# EAGLE design poe_breakout (EAGLE 9.4.2)
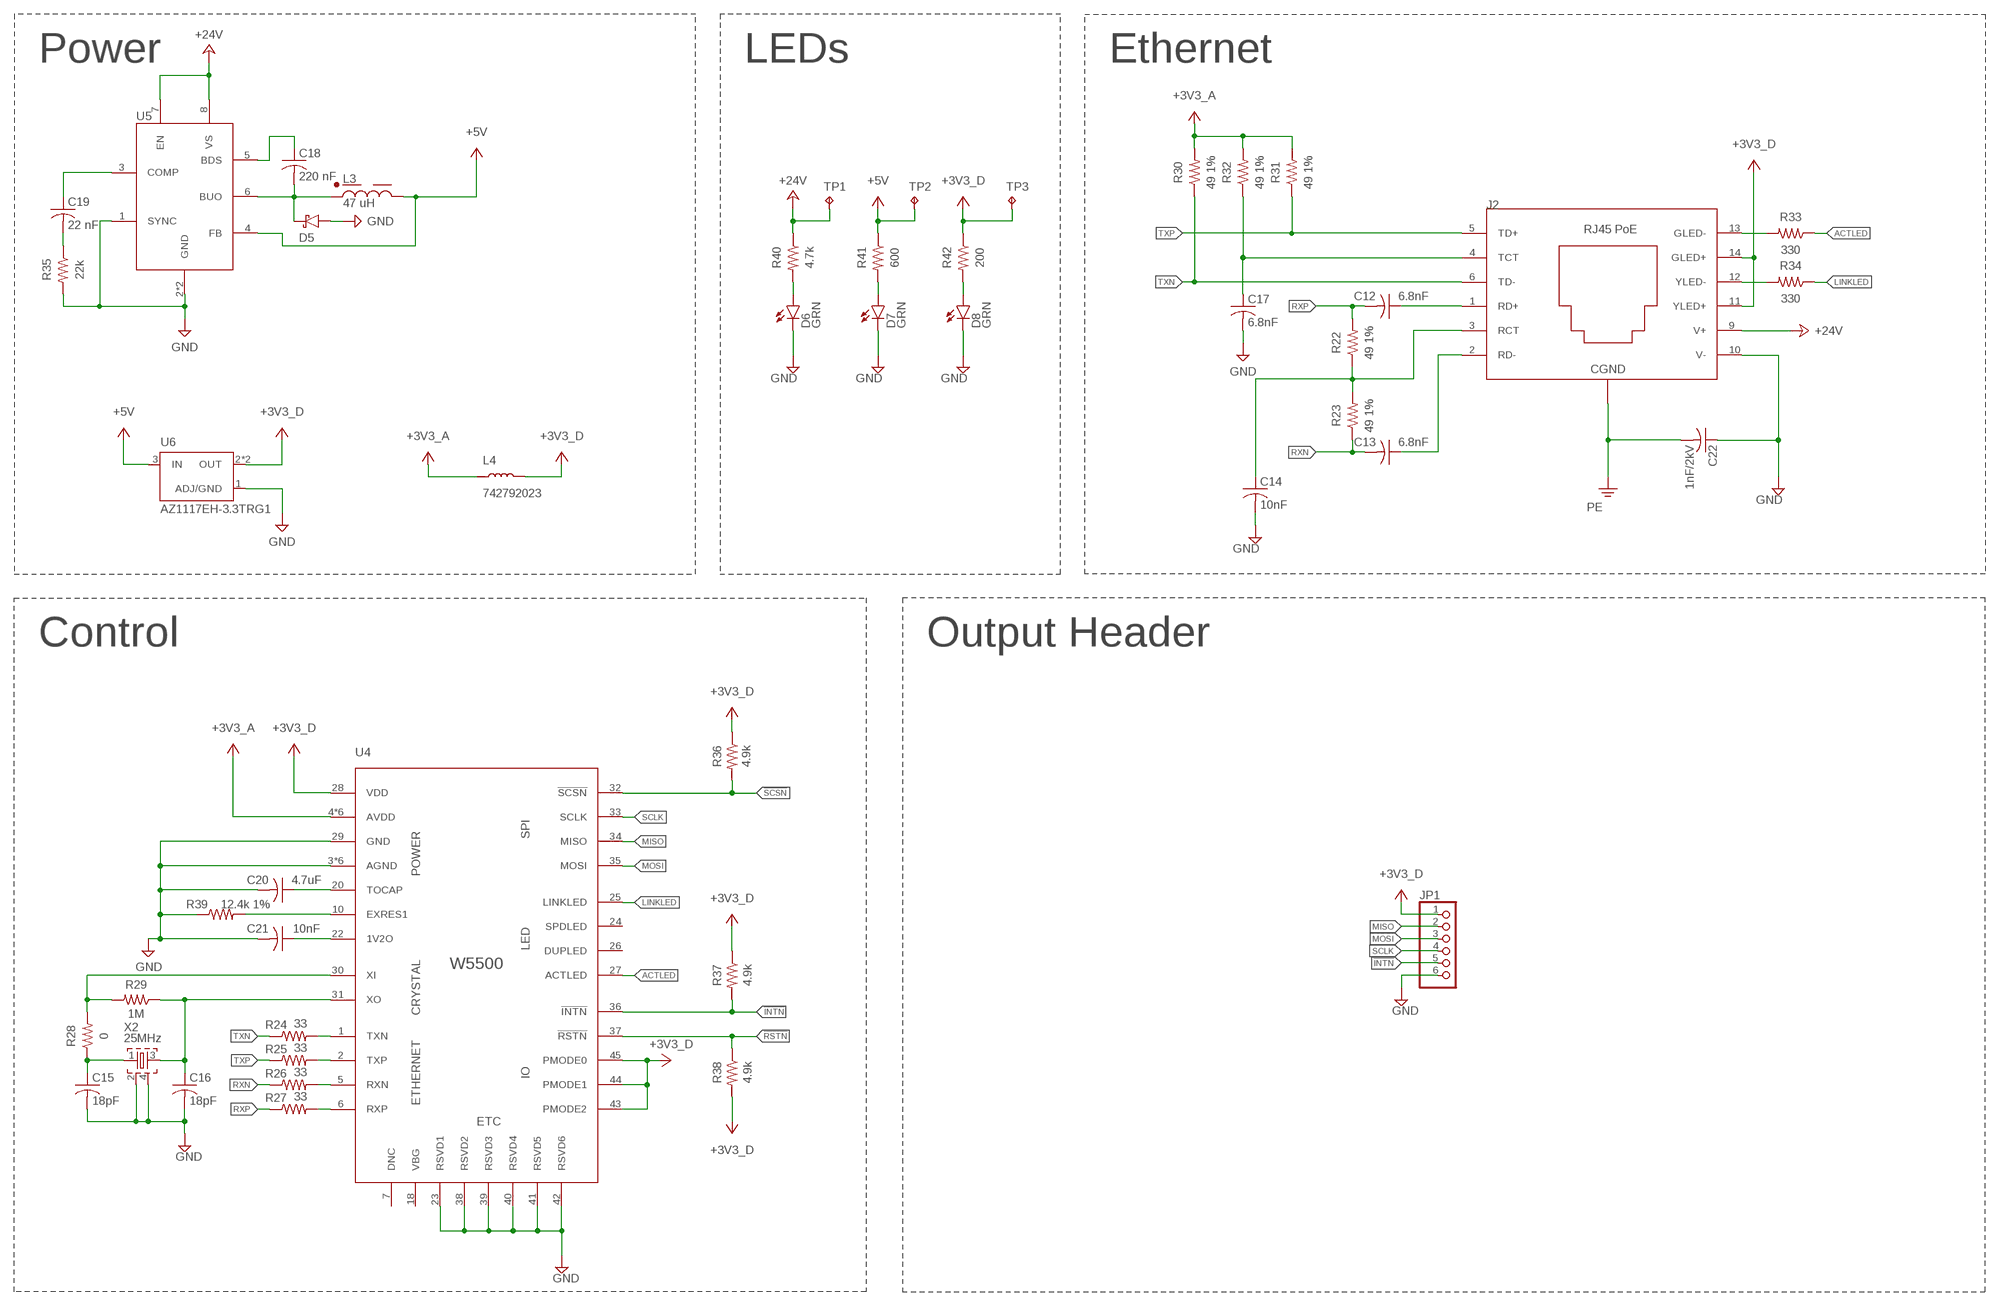
[diagram p0: schematic, sheet 1]

## Parts
C12  6.8nF  C-USC0603  [C0603]
C13  6.8nF  C-USC0603  [C0603]
C14  10nF  C-USC0603  [C0603]
C15  18pF  C-USC0603  [C0603]
C16  18pF  C-USC0603  [C0603]
C17  6.8nF  C-USC0603  [C0603]
C18  220 nF  C-USC0603  [C0603]
C19  22 nF  C-USC0603  [C0603]
C20  4.7uF  C-USC0603  [C0603]
C21  10nF  C-USC0603  [C0603]
C22  1nF/2kV  C-USC1206  [C1206]
D5  SCHOTTKYSOD-323  [SOD-323]
D6  GRN  LEDCHIP-LED0603  [CHIP-LED0603]
D7  GRN  LEDCHIP-LED0603  [CHIP-LED0603]
D8  GRN  LEDCHIP-LED0603  [CHIP-LED0603]
J2  ARJP11A  [ARJP11A-MBSB-A-B-EMU2]
JP1  PINHD-1X6  [1X06]
L3  47 uH  744771147  [744771147]
L4  742792023  INDUCTOR_0805  [0805]
R22  49 1%  R-US_R0603  [R0603]
R23  49 1%  R-US_R0603  [R0603]
R24  33  R-US_R0603  [R0603]
R25  33  R-US_R0603  [R0603]
R26  33  R-US_R0603  [R0603]
R27  33  R-US_R0603  [R0603]
R28  0  R-US_R0603  [R0603]
R29  1M  R-US_R0603  [R0603]
R30  49 1%  R-US_R0603  [R0603]
R31  49 1%  R-US_R0603  [R0603]
R32  49 1%  R-US_R0603  [R0603]
R33  330  R-US_R0603  [R0603]
R34  330  R-US_R0603  [R0603]
R35  22k  R-US_R0603  [R0603]
R36  4.9k  R-US_R0603  [R0603]
R37  4.9k  R-US_R0603  [R0603]
R38  4.9k  R-US_R0603  [R0603]
R39  12.4k 1%  R-US_R0603  [R0603]
R40  4.7k  R-US_R0603  [R0603]
R41  600  R-US_R0603  [R0603]
R42  200  R-US_R0603  [R0603]
TP1  TPB1,27  [B1,27]
TP2  TPB1,27  [B1,27]
TP3  TPB1,27  [B1,27]
U4  W5500  [48-LQFP]
U5  IFX91041  [SOIC-8-EXPOSED_PAD]
U6  AZ1117EH-3.3TRG1  [SOT230P700X180-4N]
X2  25MHz  ABM10W-25.0000MHZ-6-K1Z-T3  [OSCILLATOR-SMD-2.5X2]

## Nets
3V3_LED1: D8.A R42.2
5V_LED1: D7.A R41.2
24V_LED1: D6.A R40.2
!INTN: JP1.5 R37.2 U4.36(!INTN)
!RSTN: R38.1 U4.37(!RSTN)
!SCSN: R36.2 U4.32(!SCSN)
+3V3_A: L4.1 R30.2 R31.2 R32.2 U4.4(AVDD) U4.8(AVDD) U4.11(AVDD) U4.15(AVDD) U4.17(AVDD) U4.21(AVDD)
+3V3_D: J2.11(YLED+) J2.14(GLED+) JP1.1 L4.2 R36.1 R37.1 R38.2 R42.1 TP3.TP U4.28(VDD) U4.43(PMODE2) U4.44(PMODE1) U4.45(PMODE0) U6.2(OUT) U6.4(OUT)
+5V: L3.1 R41.1 TP2.TP U5.4(FB) U6.3(IN)
+24V: J2.9(V+) R40.1 TP1.TP U5.7(EN) U5.8(VS)
ACTLED: R33.1 U4.27(ACTLED)
GND: C14.2 C15.2 C16.2 C17.2 C20.2 C21.2 C22.1 D5.A D6.C D7.C D8.C J2.10(V-) JP1.6 R35.2 R39.1 U4.3(AGND) U4.9(AGND) U4.14(AGND) U4.16(AGND) U4.19(AGND) U4.23(RSVD1) U4.29(GND) U4.38(RSVD2) U4.39(RSVD3) U4.40(RSVD4) U4.41(RSVD5) U4.42(RSVD6) U4.48(AGND) U5.1(SYNC) U5.2(GND) U5.P$9(GND) U6.1(ADJ/GND) X2.2(SHD1) X2.4(SHD2)
LINKLED: R34.1 U4.25(LINKLED)
MISO: JP1.2 U4.34(MISO)
MOSI: JP1.3 U4.35(MOSI)
N$1: R24.2 U4.1(TXN)
N$2: R25.2 U4.2(TXP)
N$3: R26.2 U4.5(RXN)
N$6: R27.2 U4.6(RXP)
N$20: C15.1 R28.1 X2.1(IN)
N$22: R28.2 R29.2 U4.30(XI)
N$23: C16.1 R29.1 U4.31(XO) X2.3(OUT)
N$24: J2.12(YLED-) R34.2
N$25: J2.13(GLED-) R33.2
N$26: C18.2 D5.C L3.P$2 U5.6(BUO)
N$27: C18.1 U5.5(BDS)
N$28: C19.2 R35.1
N$29: C19.1 U5.3(COMP)
N$30: C21.1 U4.22(1V2O)
N$31: C20.1 U4.20(TOCAP)
N$32: R39.2 U4.10(EXRES1)
PE: C22.2 J2.15(CGND) J2.16(CGND)
RCT1: C14.1 J2.3(RCT) R22.1 R23.2
RD+1: C12.1 J2.1(RD+)
RD-1: C13.1 J2.2(RD-)
RXN: C13.2 R23.1 R26.1
RXP: C12.2 R22.2 R27.1
SCLK: JP1.4 U4.33(SCLK)
TCT1: C17.1 J2.4(TCT) R32.1
TXN: J2.6(TD-) R24.1 R30.1
TXP: J2.5(TD+) R25.1 R31.1
Unconnected: U4.7(DNC) U4.18(VBG) U4.24(SPDLED) U4.26(DUPLED)

## Notes on the sheet
- Power | LEDs | Ethernet
- Control | Output Header

## Library data of the parts
C12-C22 = rcl:C-US: CAPACITOR, American symbol; SPICEPREFIX: C
D5 = RoboJackets-Diodes:SCHOTTKY
D6-D8 = led:LED: LED OSRAM: - CHIPLED LG R971, LG N971, LY N971, LG Q971, LY Q971, LO R971, LY R971 LH N974, LH R974 LS Q976, LO Q976, LY Q976 LO Q996 - Hyper CHIPLED LW Q18S LB Q993, LB Q99A, LB R99A - SideLED LS A670, LO A670, LY A670, LG A670, LP A670 LB A673, LV A673, LT A673, LW A673 LH A674 LY A675 LS A676, LA A676, LO A676, LY A676, LW A676 LS A679, LY A679, LG A679 - Hyper Micro SIDELED® LS Y876, LA Y876, LO Y876, LY Y876 LT Y87S - SmartLED LW L88C, LW L88S LB L89C, LB L89S, LG L890 LS L89K, LO L89K, LY L89K LS L896, LA L896, LO L896, LY L896 - TOPLED LS T670, LO T670, LY T670, LG T670, LP T670 LSG T670, LSP T670, LSY T670, LOP T670, LYG T670 LG T671, LOG T671, LSG T671 LB T673, LV T673, LT T673, LW T673 LH T674 LS T676, LA T676, LO T676, LY T676, LB T676, LH T676, LSB T676, LW T676 LB T67C, LV T67C, LT T67C, LS T67K, LO T67K, LY T67K, LW E67C LS E67B, LA E67B, LO E67B, LY E67B, LB E67C, LV E67C, LT E67C LW T67C LS T679, LY T679, LG T679 LS T770, LO T770, LY T770, LG T770, LP T770 LB T773, LV T773, LT T773, LW T773 LH T774 LS E675, LA E675, LY E675, LS T675 LS T776, LA T776, LO T776, LY T776, LB T776 LHGB T686 LT T68C, LB T68C - Hyper Mini TOPLED® LB M676 - Mini TOPLED Santana® LG M470 LS M47K, LO M47K, LY M47K Source: http://www.osram.convergy.de LUXEON: - LUMILED® LXK2-PW12-R00, LXK2-PW12-S00, LXK2-PW14-U00, LXK2-PW14-V00 LXK2-PM12-R00, LXK2-PM12-S00, LXK2-PM14-U00 LXK2-PE12-Q00, LXK2-PE12-R00, LXK2-PE12-S00, LXK2-PE14-T00, LXK2-PE14-U00 LXK2-PB12-K00, LXK2-PB12-L00, LXK2-PB12-M00, LXK2-PB14-N00, LXK2-PB14-P00, LXK2-PB14-Q00 LXK2-PR12-L00, LXK2-PR12-M00, LXK2-PR14-Q00, LXK2-PR14-R00 LXK2-PD12-Q00, LXK2-PD12-R00, LXK2-PD12-S00 LXK2-PH12-R00, LXK2-PH12-S00 LXK2-PL12-P00, LXK2-PL12-Q00, LXK2-PL12-R00 Source: www.luxeon.com KINGBRIGHT: KA-3528ASYC Source: www.kingbright.com
J2 = ethernet_poe:ARJP11A: RJ45 jack with integrated magnetics and Power over Ethernet support; DKPN: ARJP11A-MBSB-A-B-EMU2-ND
JP1 = adafruit:PINHD-1X6: PIN HEADER
L3 = ethernet_poe:744771147: Wurth Elektronik SMT Shielded Power Inductor; DKPN: 732-1214-1-ND
L4 = ethernet_poe:INDUCTOR_0805
R22-R42 = rcl:R-US_: RESISTOR, American symbol; SPICEPREFIX: R
TP1-TP3 = testpad:TP: Test pad
U4 = ethernet_poe:W5500: Chip to control 10/100 Ethernet and output data over SPI; DKPN: 1278-1021-ND
U5 = ethernet_poe:IFX91041: 1.8A DC/DC Step-Down Voltage Regulator 5.0V, 3.3V, or Adjustable Output; DKPN: IFX91041EJV50XUMA1CT-ND
U6 = ethernet_poe:AZ1117EH-3.3TRG1: Ldo.Vreg Pos 3, 3v 1a Sot223; DKPN: AZ1117EH-3.3TRG1DICT-ND
X2 = ethernet_poe:ABM10W-25.0000MHZ-6-K1Z-T3: 25 MHz Oscillator; DKPN: 535-13730-1-ND

## Board
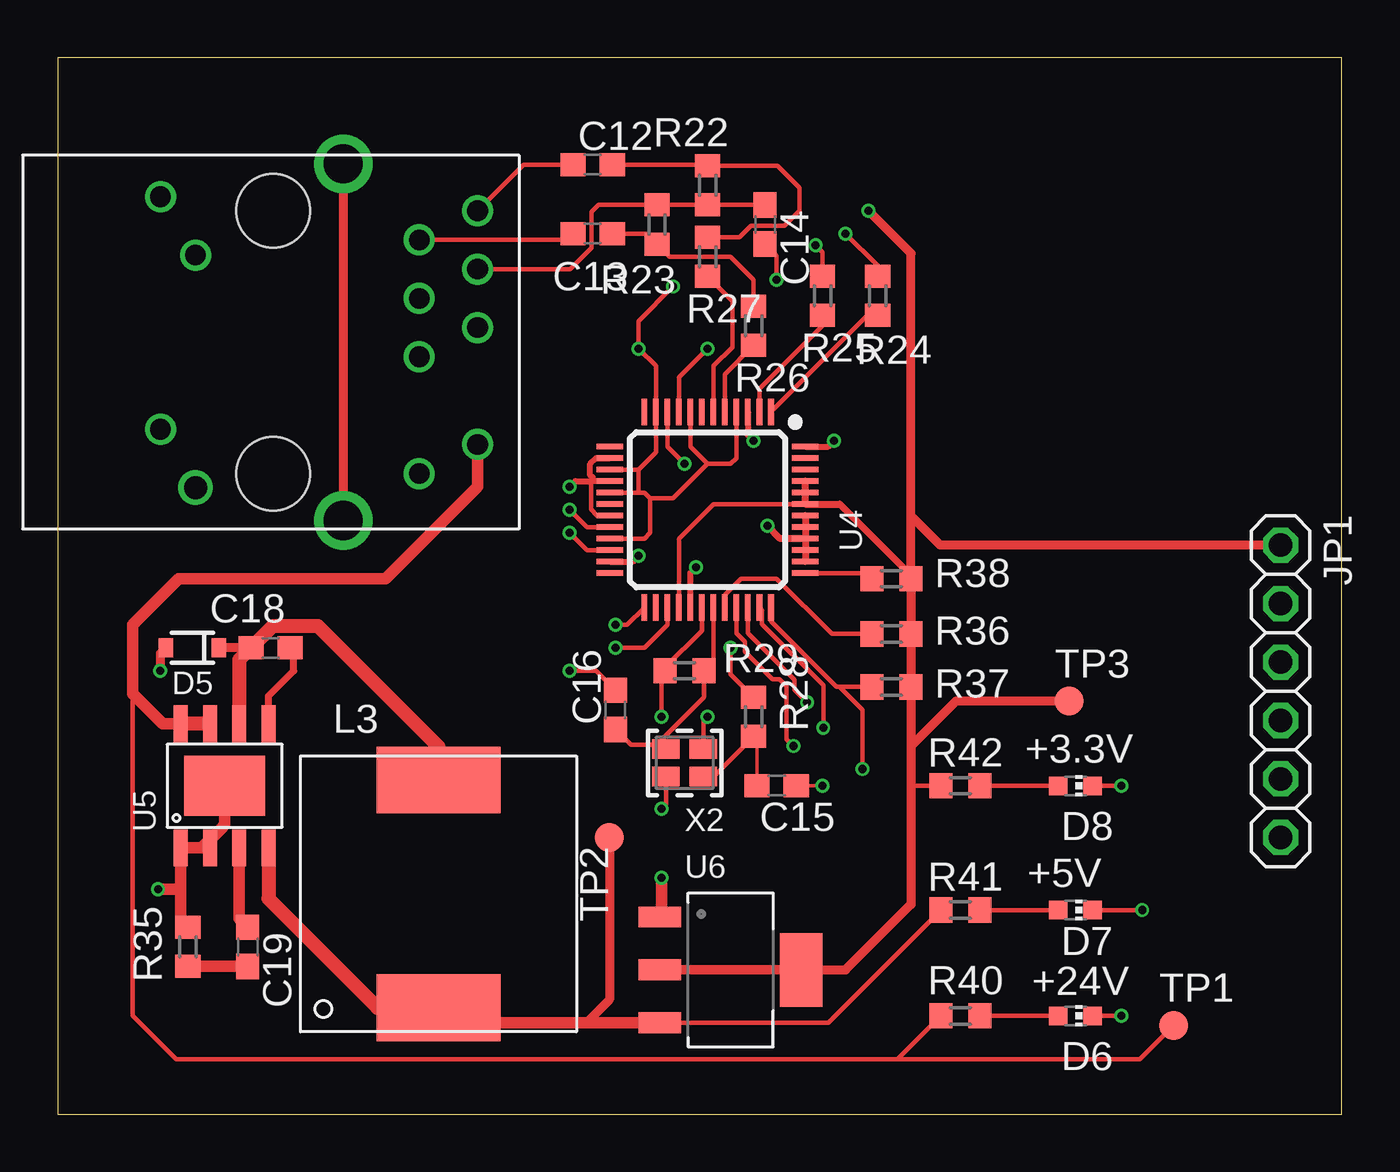
[diagram p1: board, top side]
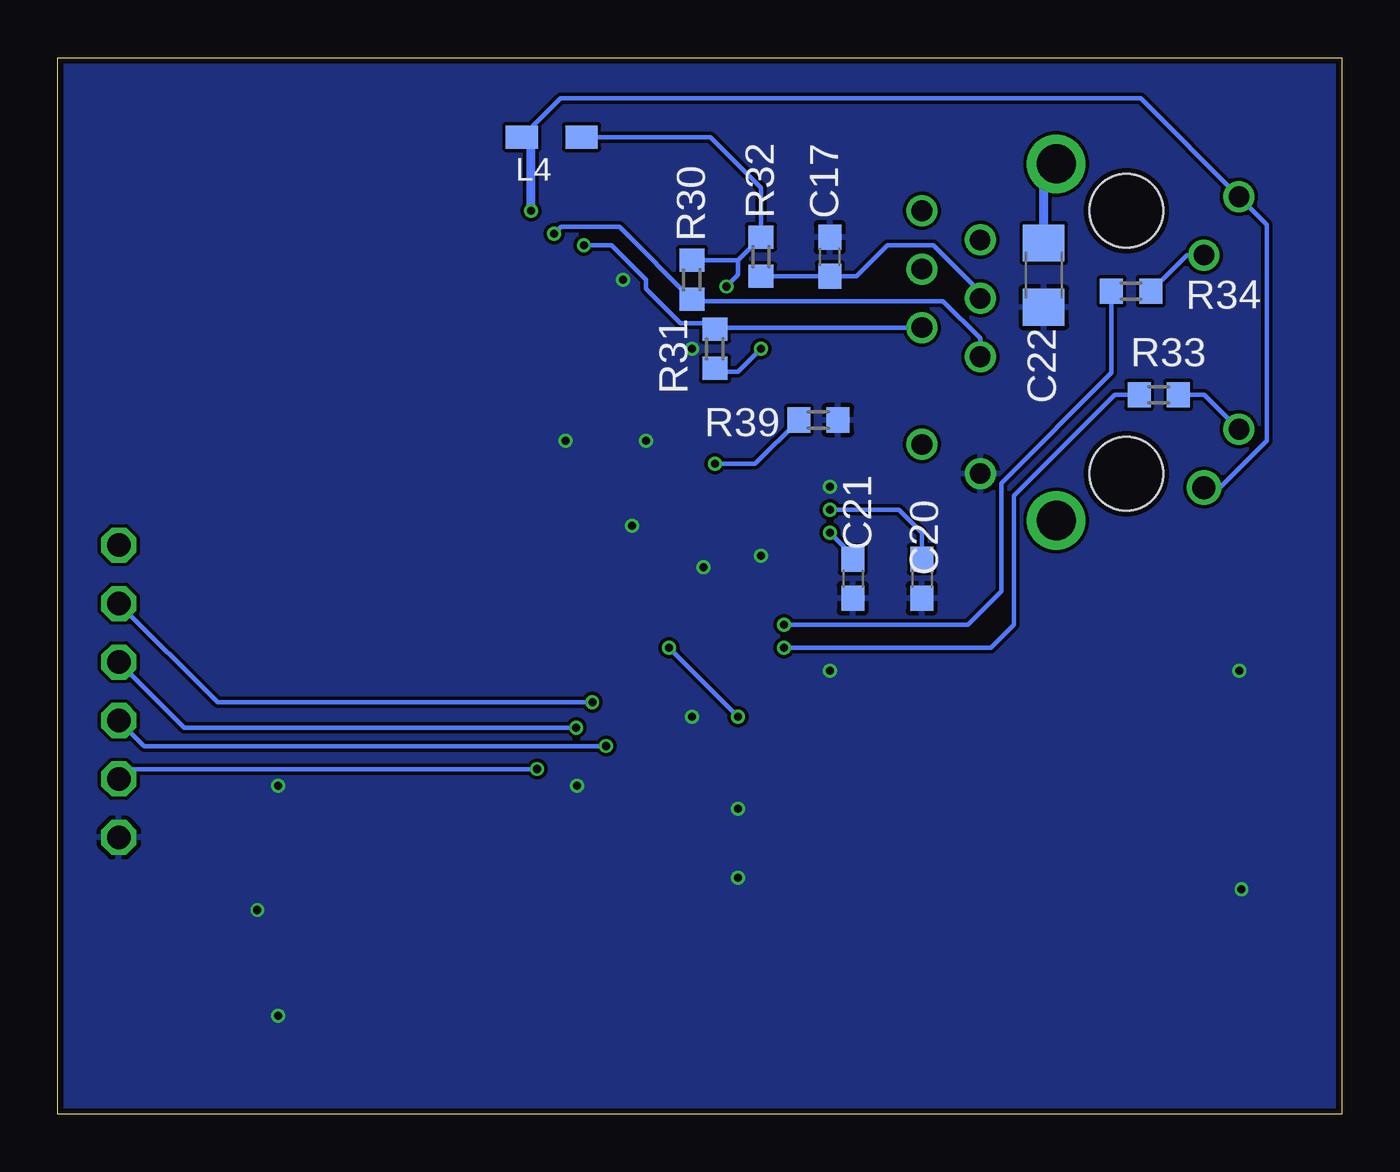
[diagram p2: board, bottom side, seen from below]

Size 55.86 x 45.93 mm. Coordinates in mm from the lower left corner, seen from the top.
Outline: 0,0 55.86,0 55.86,45.93 0,45.93 0,0
Copper layers (1*16): Top 0.018mm / dielectric 1.55mm / Bottom 0.018mm
Design rules "eC_2Layer_PClass6_BaseCopperO18_eCDefault": minimum track width 0.15mm, minimum drill 0.35mm, track to track 0.15mm, track to pad 0.15mm, pad to pad 0.15mm, via to via 0.15mm, smd to smd 0mil, copper to edge 0.25mm, drill to drill 0.35mm, minimum pad ring 0.175mm, minimum via ring 0.125mm, stop-mask expansion 0mil, vias tented up to drill 0.45mm, thermal gap 0.2mm

### Footprints (pad centres in the part's own frame; a part is rotated, then mirrored left to right if it is on the bottom)
C0603 = smd 1.1 x 1: 1 -0.85,0; 2 0.85,0
C1206 = smd 1.6 x 1.8: 1 -1.4,0; 2 1.4,0
SOD-323 = smd 0.63 x 0.83: A 1.15,0; C -1.15,0
CHIP-LED0603 = smd 0.8 x 0.8: A 0,-0.75; C 0,0.75
ARJP11A-MBSB-A-B-EMU2 = drill 0.9: 1 0,0; 2 1.27,-2.54; 3 2.54,0; 4 3.81,-2.54; 5 5.08,0; 6 6.35,-2.54; 9 10.16,0; 10 11.43,-2.54; 11 -0.61,-13.79; 12 1.93,-12.27; 13 9.5,-13.79 | drill 1: 14 12.04,-12.27 | drill 1.7: 15 -2.035,-5.84; 16 13.465,-5.84 | hole 3.2: 11.43,-8.89; 0,-8.89
1X06 = drill 1.016 octagon: 1 -6.35,0; 2 -3.81,0; 3 -1.27,0; 4 1.27,0; 5 3.81,0; 6 6.35,0
744771147 = smd 5.4 x 2.9: 1 0,4.95; P$2 0,-4.95
0805 = smd 1.4 x 1: 1 -1.3,0; 2 1.3,0
R0603 = smd 1 x 1.1: 1 -0.85,0; 2 0.85,0
B1,27 = smd 1.27 x 1.27: TP 0,0
48-LQFP = smd 1.143 x 0.254: 1 -4.25,2.75; 2 -4.25,2.25; 3 -4.25,1.75; 4 -4.25,1.25; 5 -4.25,0.75; 6 -4.25,0.25; 7 -4.25,-0.25; 8 -4.25,-0.75; 9 -4.25,-1.25; 10 -4.25,-1.75; 11 -4.25,-2.25; 12 -4.25,-2.75; 25 4.25,-2.75; 26 4.25,-2.25; 27 4.25,-1.75; 28 4.25,-1.25; 29 4.25,-0.75; 30 4.25,-0.25; 31 4.25,0.25; 32 4.25,0.75; 33 4.25,1.25; 34 4.25,1.75; 35 4.25,2.25; 36 4.25,2.75 | smd 0.254 x 1.143: 13 -2.75,-4.25; 14 -2.25,-4.25; 15 -1.75,-4.25; 16 -1.25,-4.25; 17 -0.75,-4.25; 18 -0.25,-4.25; 19 0.25,-4.25; 20 0.75,-4.25; 21 1.25,-4.25; 22 1.75,-4.25; 23 2.25,-4.25; 24 2.75,-4.25; 37 2.75,4.25; 38 2.25,4.25; 39 1.75,4.25; 40 1.25,4.25; 41 0.75,4.25; 42 0.25,4.25; 43 -0.25,4.25; 44 -0.75,4.25; 45 -1.25,4.25; 46 -1.75,4.25; 47 -2.25,4.25; 48 -2.75,4.25
SOIC-8-EXPOSED_PAD = smd 1.6 x 0.61: 1 -2.7,1.905; 2 -2.7,0.635; 3 -2.7,-0.635; 4 -2.7,-1.905; 5 2.7,-1.905; 6 2.7,-0.635; 7 2.7,0.635; 8 2.7,1.905 | smd 2.62 x 3.51: P$9 0,0
SOT230P700X180-4N = smd 1.86 x 0.9: 1 -3.075,2.3; 2 -3.075,0; 3 -3.075,-2.3 | smd 1.86 x 3.19: 4 3.075,0
OSCILLATOR-SMD-2.5X2 = smd 1.2 x 0.85: 1 -0.812,0.6; 2 0.812,0.6; 3 0.812,-0.6; 4 -0.812,-0.6

### Placement (x,y rotation side)
C12  23.27,41.27 0 top
C13  23.27,38.27 0 top
C14  30.77,38.67 270 top
C15  31.27,14.27 0 top
C16  24.27,17.57 90 top
C17  22.27,37.27 90 bottom
C18  9.27,20.27 180 top
C19  8.27,7.27 270 top
C20  18.27,23.27 270 bottom
C21  21.27,23.27 270 bottom
C22  12.97,36.47 90 bottom
D5  5.87,20.27 180 top
D6  44.27,4.27 270 top
D7  44.27,8.87 270 top
D8  44.27,14.27 270 top
J2  18.27,39.27 270 top
JP1  53.19,18.38 270 top
L3  16.57,9.57 180 top
L4  34.37,42.47 180 bottom
R22  28.27,40.37 90 top
R23  26.07,38.67 90 top
R24  35.67,35.57 270 top
R25  33.27,35.57 270 top
R26  30.27,34.27 270 top
R27  28.27,37.27 270 top
R28  30.27,17.27 90 top
R29  27.27,19.27 180 top
R30  28.27,36.27 90 bottom
R31  27.27,33.27 270 bottom
R32  25.27,37.27 90 bottom
R33  7.97,31.27 0 bottom
R34  9.17,35.77 0 bottom
R35  5.67,7.27 90 top
R36  36.27,20.87 180 top
R37  36.27,18.57 180 top
R38  36.27,23.27 0 top
R39  22.77,30.17 180 bottom
R40  39.27,4.27 0 top
R41  39.27,8.87 0 top
R42  39.27,14.27 0 top
TP1  48.54,3.86 0 top
TP2  24,12.03 0 top
TP3  44,17.95 0 top
U4  28.27,26.27 270 top
U5  7.27,14.27 90 top
U6  29.27,6.27 0 top
X2  27.27,15.27 180 top

### Tracks (layer width: path | path; a pad name or v marks a point on that pad's centre or on a via)
3V3_LED1
  Top 0.2: D8.A R42.2
5V_LED1
  Top 0.2: D7.A R41.2
24V_LED1
  Top 0.2: D6.A R40.2
!INTN  (via drill 0.35)
  Top 0.2: U4.36 31.02,21.42 33.87,18.57 | 33.87,18.57 34,18.57 | 34,18.57 R37.2 | 34,18.57 33.87,18.57 | 34,18.57 35,17.57 v35,15
  Bottom 0.2: v35,15 52.76,15 JP1.5
!RSTN
  Top 0.2: U4.37 35.17,23.52 R38.1
!SCSN
  Top 0.2: R36.2 33.67,20.87 31.27,23.27 29.71,23.27 29.02,22.57 U4.32
+3V3_A  (via drill 0.35)
  Top 0.2: U4.15 25.27,28.02 | 25.77,26.77 25.77,25.27 25.52,25.02 U4.21 | 25.77,26.77 25.52,27.02 25.27,27.02 | 25.27,27.02 U4.17 | 25.27,27.02 25.27,28.02 | v26.77,35.98 25.27,34.48 v25.27,33.27 26.02,32.52 26.02,30.27 | U4.11 26.02,28.77 25.27,28.02 | U4.8 27.52,29.02 28.27,28.27 | 28.27,28.27 29.27,28.27 29.52,28.52 U4.4 | 28.27,28.27 26.77,26.77 25.77,26.77
  Top 0.254: 26.02,30.27 U4.11
  Bottom 0.2: R30.2 26.27,37.12 | 26.27,37.12 R32.2 25.27,40.27 27.47,42.47 L4.1 | R31.2 27.12,32.27 26.27,32.27 v25.27,33.27 | 26.27,37.12 26.27,36.48 v26.77,35.98
+3V3_D  (via drill 0.35)
  Top 0.2: 37.12,14.27 R42.1 | U4.28 27.02,25.02 28.52,26.52 U4.43
  Top 0.3: U4.45 U4.44 U4.43 34.02,26.52 37.12,23.42
  Top 0.4: R38.2 37.12,23.42 | R38.2 R36.1 R37.1 37.12,17 37.12,16 | 37.12,16 37.12,14.27 37.12,9.12 34.27,6.27 U6.4 | R38.2 37.12,26 | 37.12,26 37.12,37.42 v35.27,39.27 | TP3.TP 39.07,17.95 37.12,16 | JP1.1 38.39,24.73 37.12,26
  Top 0.406: U6.2 U6.4
  Bottom 0.2: L4.2 33.99,44.15 8.75,44.15 J2.11 3.27,38.67 3.27,29.27 5.31,27.23 J2.14
  Bottom 0.4: v35.27,39.27 35.27,42.07 L4.2
+5V
  Top 0.2: U6.3 33.52,3.97 R41.1
  Top 0.3: L3.1 13.92,4.62
  Top 0.4: TP2.TP 24,4.97 23,3.97
  Top 0.5: U6.3 23,3.97 17.22,3.97 L3.1
  Top 0.6: U5.4 9.18,9.37 13.92,4.62
+24V
  Top 0.2: 3.27,18.27 3.27,4.27 5.15,2.39 36.54,2.39 | 36.54,2.39 37.08,2.92 R40.1 | 36.54,2.39 47.07,2.39 TP1.TP
  Top 0.5: 6.27,16.97 4.57,16.97 3.27,18.27 3.27,21.27 4,22 5.27,23.27 14.27,23.27 18.27,27.27 J2.9
  Top 0.61: U5.7 6.27,16.97 U5.8
ACTLED  (via drill 0.35)
  Top 0.2: U4.27 26.52,21.27 25.52,20.27 v24.27,20.27
  Bottom 0.2: R33.1 9.87,31.27 14.27,26.87 14.27,21.27 15.27,20.27 v24.27,20.27
GND  (via drill 0.35)
  Top 0.152: C15.2 v33.27,14.27
  Top 0.2: U4.19 23.46,26.02 23.2,26.29 23.2,27.45 23.27,27.52 | C14.2 31.27,37.32 v31.27,36.27 | X2.4 28.08,17.08 v28.27,17.27 | X2.2 26.46,13.46 v26.27,13.27 | D8.C v46.27,14.27 | v47.17,8.87 D7.C | D6.C v46.27,4.27 | U4.9 27.02,32.02 v28.27,33.27 | C16.2 23.42,19.27 v22.27,19.27
  Top 0.254: U4.16 23.27,27.52 | 23.27,27.52 22.52,27.52 v22.27,27.27 | U4.48 33.52,29.02 v33.77,29.27 | U4.3 30.02,29.52 v30.27,29.27 | U4.29 27.52,23.52 v27.77,23.77 | U4.23 25.02,24.02 v25.27,24.27 | 23.27,27.52 23.27,27.68 23.17,27.78 23.17,28.26 23.43,28.52 U4.14
  Top 0.3: U4.42 U4.41 U4.40 | U4.40 U4.39 U4.38 | v30.87,25.57 31.42,25.02 U4.40
  Top 0.4: D5.A 4.47,20.02 v4.47,19.27
  Top 0.5: U5.2 6.27,11.57 | 6.27,11.57 U5.1 5.37,9.77 | R35.2 5.37,8.43 5.37,9.77 | U6.1 26.27,8.64 v26.27,10.27 | U5.P$9 7.27,12.61 7.2,12.54 7.2,12.5 6.27,11.57 | 5.37,9.77 v4.37,9.77
  pour Bottom: 0,46 56,46 56,0 0,0
LINKLED  (via drill 0.35)
  Top 0.2: U4.25 24.77,21.27 v24.27,21.27
  Bottom 0.2: R34.1 10.02,32.22 14.82,27.42 14.82,22.72 16.27,21.27 v24.27,21.27
MISO  (via drill 0.35)
  Top 0.2: U4.34 30.02,20.91 32.05,18.88 32.05,18.45 v32.6,17.9
  Bottom 0.2: JP1.2 48.9,17.9 v32.6,17.9
MOSI  (via drill 0.35)
  Top 0.2: U4.35 30.64,21.9 30.64,21.3 33.3,18.64 v33.3,16.8
  Bottom 0.2: JP1.3 50.34,16.8 v33.3,16.8
N$1
  Top 0.2: U4.1 35.22,34.72 R24.2
N$2
  Top 0.2: R25.2 33.27,34.27 30.52,31.52 U4.2
N$3
  Top 0.2: U4.5 29.02,32.17 R26.2
N$6
  Top 0.2: R27.2 29.34,35.34 29.34,33.34 28.52,32.52 U4.6
N$20
  Top 0.152: C15.1 30.42,16.12 30.2,16.34
  Top 0.2: R28.1 30.2,16.34 28.52,14.67 X2.1
N$22  (via drill 0.35)
  Top 0.2: U4.30 28.02,21.02 26.42,19.42 26.27,19.42 R29.2 26.27,19.12 v26.27,17.27 | R28.2 29.27,19.12 v29.27,20.27
  Bottom 0.2: v26.27,17.27 v29.27,20.27
N$23
  Top 0.2: U4.31 28.52,19.67 R29.1 28.12,18.12 26.27,16.27 26.27,16.06 | 26.27,16.06 X2.3 | C16.1 24.93,16.06 26.27,16.06
N$24
  Bottom 0.2: J2.12 6.75,37.34 R34.2
N$25
  Bottom 0.2: J2.13 5.98,31.27 R33.2
N$26
  Top 0.4: C18.2 D5.C
  Top 0.5: L3.P$2 16.57,15.97
  Top 0.6: U5.6 7.91,19.75 C18.2 9.38,21.22 11.32,21.22 16.27,16.27 16.57,15.97
N$27
  Top 0.305: U5.5 9.18,18.18 10.27,19.27 10.27,20.12 C18.1
N$28
  Top 0.5: R35.1 C19.2
N$29
  Top 0.508: U5.3 7.91,8.48 C19.1
N$30  (via drill 0.35)
  Top 0.2: U4.22 23.02,24.52 v22.27,25.27
  Bottom 0.2: v22.27,25.27 21.27,24.27 C21.1
N$31  (via drill 0.35)
  Top 0.2: U4.20 23.02,25.52 v22.27,26.27
  Bottom 0.2: v22.27,26.27 19.27,26.27 18.27,25.27 C20.1
N$32  (via drill 0.35)
  Top 0.2: U4.10 26.52,29.02 v27.27,28.27
  Bottom 0.2: R39.2 25.52,28.27 v27.27,28.27
PE
  Top 0.4: J2.15 J2.16
  Bottom 0.4: C22.2 12.97,40.77 J2.15
RCT1
  Top 0.2: J2.3 22.29,36.73 23.22,37.66 23.22,39.22 23.27,39.27 23.52,39.52 R23.2 R22.1 C14.1
RD+1
  Top 0.2: J2.1 20.27,41.27 C12.1
RD-1
  Top 0.2: C13.1 22.15,38 J2.2
RXN
  Top 0.2: R26.1 30.27,36.27 29.27,37.27 26.62,37.27 R23.1 25.62,38.27 C13.2
RXP
  Top 0.2: C12.2 28.22,41.27 R22.2 31.32,41.22 32.27,40.27 32.27,39.27 31.62,38.62 30.16,38.62 29.66,38.12 R27.1
SCLK  (via drill 0.35)
  Top 0.2: U4.33 29.52,20.91 29.9,20.53 29.9,20.1 31.1,18.9 31.4,18.9 31.7,18.6 31.7,16.3 v32,16
  Bottom 0.2: JP1.4 52.08,16 v32,16
TCT1
  Bottom 0.2: J2.4 15.73,35.73 17.77,37.77 19.77,37.77 21.12,36.42 C17.1 R32.1
TXN  (via drill 0.35)
  Top 0.2: v34.27,38.27 35.67,36.87 R24.1
  Bottom 0.152: 28.2,35.34 R30.1
  Bottom 0.2: J2.6 15.73,33.73 17.34,35.34 28.2,35.34 31.42,38.57 33.97,38.57 v34.27,38.27
TXP  (via drill 0.35)
  Top 0.2: v32.97,37.77 33.27,37.47 R25.1
  Bottom 0.152: 27.2,34.19 R31.1
  Bottom 0.2: J2.5 27.2,34.19 R31.1 27.52,34.37 | 27.52,34.37 28.27,34.37 | 28.27,34.37 28.77,34.37 30.27,35.87 30.27,36.27 31.77,37.77 v32.97,37.77 | 27.52,34.37 28.27,34.37

### Text on the board
tPlace: +3.3V | +5V | +24V